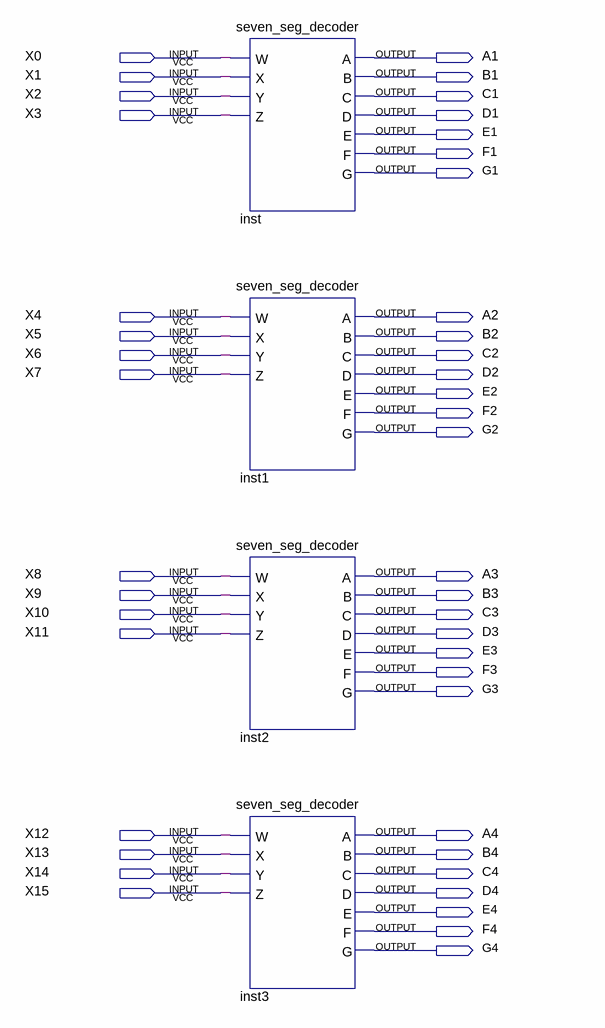
[diagram p0: schematic sheet]
// Quartus schematic lab5step1.bdf as structural Verilog: 4 symbols, 44 pins
module lab5step1 (
  input  X0,
  input  X1,
  input  X2,
  input  X3,
  input  X4,
  input  X5,
  input  X6,
  input  X7,
  input  X8,
  input  X9,
  input  X10,
  input  X11,
  input  X12,
  input  X13,
  input  X14,
  input  X15,
  output A1,
  output B1,
  output C1,
  output D1,
  output E1,
  output F1,
  output G1,
  output A2,
  output B2,
  output C2,
  output D2,
  output E2,
  output F2,
  output G2,
  output A3,
  output B3,
  output C3,
  output D3,
  output E3,
  output F3,
  output G3,
  output A4,
  output B4,
  output C4,
  output D4,
  output E4,
  output F4,
  output G4
);

  seven_seg_decoder inst (.W(X0), .X(X1), .Y(X2), .Z(X3), .A(A1), .B(B1), .C(C1), .D(D1), .E(E1), .F(F1), .G(G1));
  seven_seg_decoder inst1 (.W(X4), .X(X5), .Y(X6), .Z(X7), .A(A2), .B(B2), .C(C2), .D(D2), .E(E2), .F(F2), .G(G2));
  seven_seg_decoder inst2 (.W(X8), .X(X9), .Y(X10), .Z(X11), .A(A3), .B(B3), .C(C3), .D(D3), .E(E3), .F(F3), .G(G3));
  seven_seg_decoder inst3 (.W(X12), .X(X13), .Y(X14), .Z(X15), .A(A4), .B(B4), .C(C4), .D(D4), .E(E4), .F(F4), .G(G4));
endmodule
